# Altium schematic sheet Display.SchDoc
size A3; SheetNumber: 1; SheetTotal: 1
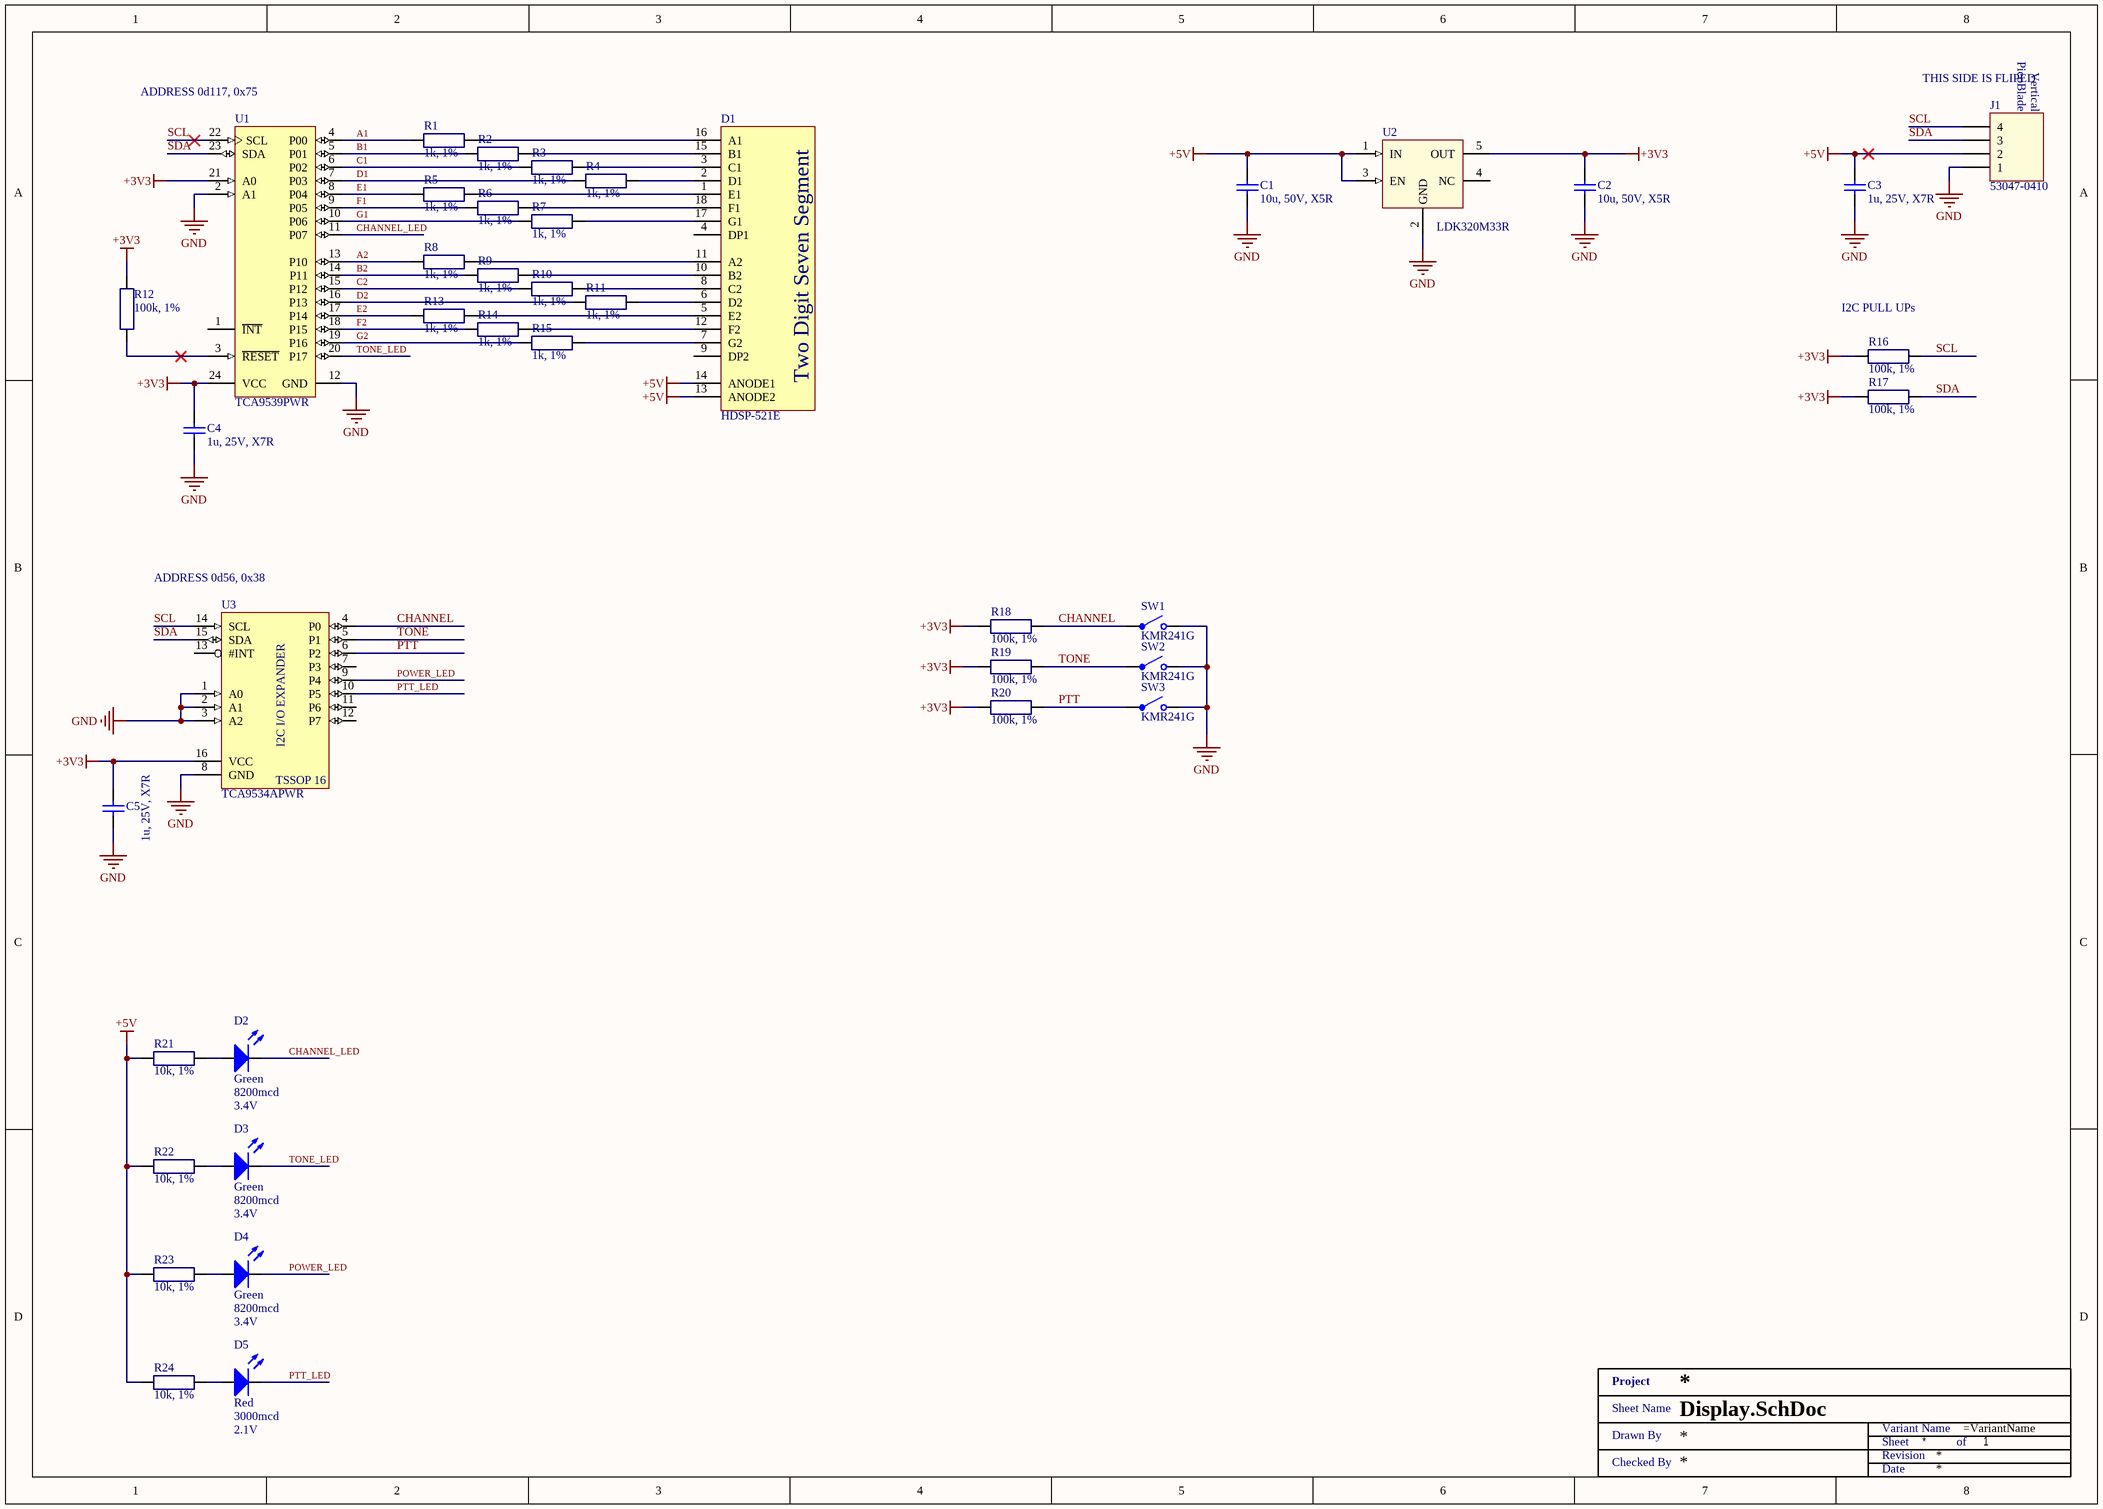
[diagram p0: Display.SchDoc]

## Parts
C1  10u, 50V, X5R  [SMD1206]
C2  10u, 50V, X5R  [SMD1206]
C3  1u, 25V, X7R  [SMD0603]
C4  1u, 25V, X7R  [SMD0603]
C5  1u, 25V, X7R  [SMD0603]
D1  HDSP-521E  [HDSP-521E]
D2  Green  Luminous Intensity: 8200mcd  Forward Voltage: 3.4V  [Cree C566D green]
D3  Green  Luminous Intensity: 8200mcd  Forward Voltage: 3.4V  [Cree C566D green]
D4  Green  Luminous Intensity: 8200mcd  Forward Voltage: 3.4V  [Cree C566D green]
D5  Red  Luminous Intensity: 3000mcd  Forward Voltage: 2.1V  [Cree C566D RED]
J1  53047-0410  [530470410]
R1  1k, 1%  [SMD0603 - R]
R2  1k, 1%  [SMD0603 - R]
R3  1k, 1%  [SMD0603 - R]
R4  1k, 1%  [SMD0603 - R]
R5  1k, 1%  [SMD0603 - R]
R6  1k, 1%  [SMD0603 - R]
R7  1k, 1%  [SMD0603 - R]
R8  1k, 1%  [SMD0603 - R]
R9  1k, 1%  [SMD0603 - R]
R10  1k, 1%  [SMD0603 - R]
R11  1k, 1%  [SMD0603 - R]
R12  100k, 1%  [SMD0603 - R]
R13  1k, 1%  [SMD0603 - R]
R14  1k, 1%  [SMD0603 - R]
R15  1k, 1%  [SMD0603 - R]
R16  100k, 1%  [SMD0603 - R]
R17  100k, 1%  [SMD0603 - R]
R18  100k, 1%  [SMD0603 - R]
R19  100k, 1%  [SMD0603 - R]
R20  100k, 1%  [SMD0603 - R]
R21  10k, 1%  [SMD0603 - R]
R22  10k, 1%  [SMD0603 - R]
R23  10k, 1%  [SMD0603 - R]
R24  10k, 1%  [SMD0603 - R]
SW1  KMR241G  [KMR2]
SW2  KMR241G  [KMR2]
SW3  KMR241G  [KMR2]
U1  TCA9539PWR  [PW0024A_M]
U2  LDK320M33R  [SOT23-5]
U3  TCA9534APWR  [TSSOP16N]
XX?  Title 1  (value not drawn)  (graphical)

## Nets
+3V3: C2.2 C4.1 C5.1 R12.1 R16.1 R17.1 R18.2 R19.2 R20.2 U1.21(A0) U1.24(VCC) U2.5(OUT) U3.16(VCC)
+5V: C1.2 C3.1 D1.13(ANODE2) D1.14(ANODE1) J1.2 R21.1 R22.1 R23.1 R24.1 U2.1(IN) U2.3(EN)
GND: C1.1 C2.1 C3.2 C4.2 C5.2 J1.1 SW1.2 SW2.2 SW3.2 U1.2(A1) U1.12(GND) U2.2(GND) U3.1(A0) U3.2(A1) U3.3(A2) U3.8(GND)
A1: R1.2 U1.4(P00)
A2: R8.2 U1.13(P10)
B1: R2.2 U1.5(P01)
B2: R9.2 U1.14(P11)
C1: R3.2 U1.6(P02)
C2: R10.2 U1.15(P12)
CHANNEL: R18.1 SW1.1 U3.4(P0)
CHANNEL_LED: D2.2(K) U1.11(P07)
D1: R4.2 U1.7(P03)
D2: R11.2 U1.16(P13)
E1: R5.2 U1.8(P04)
E2: R13.2 U1.17(P14)
F1: R6.2 U1.9(P05)
F2: R14.2 U1.18(P15)
G1: R7.2 U1.10(P06)
G2: R15.2 U1.19(P16)
POWER_LED: D4.2(K) U3.9(P4)
PTT: R20.1 SW3.1 U3.6(P2)
PTT_LED: D5.2(K) U3.10(P5)
SCL: J1.4 R16.2 U1.22(SCL) U3.14(SCL)
SDA: J1.3 R17.2 U1.23(SDA) U3.15(SDA)
TONE: R19.1 SW2.1 U3.5(P1)
TONE_LED: D3.2(K) U1.20(P17)
NetD1_1: D1.1(E1) R5.1
NetD1_2: D1.2(D1) R4.1
NetD1_3: D1.3(C1) R3.1
NetD1_5: D1.5(E2) R13.1
NetD1_6: D1.6(D2) R11.1
NetD1_7: D1.7(G2) R15.1
NetD1_8: D1.8(C2) R10.1
NetD1_10: D1.10(B2) R9.1
NetD1_11: D1.11(A2) R8.1
NetD1_12: D1.12(F2) R14.1
NetD1_15: D1.15(B1) R2.1
NetD1_16: D1.16(A1) R1.1
NetD1_17: D1.17(G1) R7.1
NetD1_18: D1.18(F1) R6.1
NetD2_1: D2.1(A) R21.2
NetD3_1: D3.1(A) R22.2
NetD4_1: D4.1(A) R23.2
NetD5_1: D5.1(A) R24.2
NetR12_2: R12.2 U1.3(~{RESET})

Not connected (* = marked no-connect by the designer): D1 4(DP1) 9(DP2); U1 1(~{INT}); U2 4(NC); U3 7(P3) 11(P6) 12(P7) 13(#INT)

## Notes on the sheet
- (near U1) ADDRESS 0d117, 0x75
- (near J1) THIS SIDE IS FLIPED
- (near R16) I2C PULL UPs
- (near U3) ADDRESS 0d56, 0x38
- (in symbol 53047-0410) PicoBlade; Vertical
- (in symbol HDSP-521E) Two Digit Seven Segment
- (in symbol TCA9534APWR) I2C I/O EXPANDER; TSSOP 16
- (in symbol Title 1) Project; Sheet Name; Variant Name; Drawn By; Sheet; of; Revision; Checked By; Date

## Library data of the parts
C1 C2 = UMK316BBJ106KL-T: CAP CER 10UF 50V X5R 1206; Manufacturer: Taiyo Yuden; Tolerance: 10%; Supplier 1: Mouser; Supplier Part Number 1: 963-UMK316BBJ106KL-T; Manufacturer Part Number: UMK316BBJ106KL-T; RoHS: Yes; Category: Ceramic Capacitors; Stock 1: 207945; Pricing 1: 1=0,42000, 10=0,18000, 100=0,12800, 500=0,11000, 1000=0,09700, 2000=0,08000 (USD); Mount: Surface Mount; Case/Package: 1206; Min Operating Temperature: -55°C; Max Operating Temperature: 85°C; Packaging: Tape and Reel; Capacitance: 10u; Voltage Rating: 50V; Length: 0.126inch; Width: 0.063inch; Thickness: 0.071inch; Lead Free: Lead Free; ComponentLink1URL: http://ds.yuden.co.jp/TYCOMPAS/ut/detail.do?productNo=UMK316BBJ106KL-T&fileName=UMK316BBJ106KL-T_SS&mode=specSheetDownload&src-supplier=Digi-Key; ComponentLink1Description: http://ds.yuden.co.jp/TYCOMPAS/ut/detail.do?productNo=UMK316BBJ106KL-T&fileName=UMK316BBJ106KL-T_SS&mode=specSheetDownload&src-supplier=Digi-Key; ComponentLink2URL: https://www.yuden.co.jp/productdata/catalog/mlcc01_e.pdf?src-supplier=Digi-Key; ComponentLink2Description: https://www.yuden.co.jp/productdata/catalog/mlcc01_e.pdf?src-supplier=Digi-Key; ComponentLink3URL: http://www.yuden.co.jp/productdata/catalog/en/mlcc_all_e.pdf?src-supplier=Digi-Key; ComponentLink3Description: http://www.yuden.co.jp/productdata/catalog/en/mlcc_all_e.pdf?src-supplier=Digi-Key; Supplier 2: Digi-Key; Supplier Part Number 2: 587-5960-1-ND; Supplier 3: Avnet; Supplier Part Number 3: UMK316BBJ106KL-T
C3-C5 = CGA3E1X7R1E105K080AC: CAP CER 1UF 25V X7R 0603; Manufacturer: TDK Corporation; Tolerance: ±10%; Manufacturer Part Number: CGA3E1X7R1E105K080AC; RoHS: RoHS Compliant; Category: Capacitors; Stock 1: 109509; Pricing 1: 1=0.2, 10=0.135, 100=0.0686, 500=0.04696, 1000=0.04154 (USD); Packaging: Cut Tape (CT); Part Status: Active; Voltage - Rated: 25V; Temperature Coefficient: X7R; Operating Temperature: -55°C ~ 125°C; Features: -; Ratings: AEC-Q200; Applications: Automotive; Failure Rate: -; Mounting Type: Surface Mount, MLCC; Package / Case: 0603 (1608 Metric); Size / Dimension: 0.063" L x 0.032" W (1.60mm x 0.80mm); Height - Seated (Max): -; Thickness (Max): 0.035" (0.90mm); Lead Spacing: -; Lead Style: -; ComponentLink1URL: https://product.tdk.com/info/en/catalog/datasheets/mlcc_automotive_general_en.pdf; ComponentLink1Description: https://product.tdk.com/info/en/catalog/datasheets/mlcc_automotive_general_en.pdf; Capacitance: 1u; Supplier 1: Mouser; Supplier Part Number 1: 810-CGA3E1X7R1E105K; Supplier 2: Farnell; Supplier Part Number 2: 2346962; Supplier 3: Digi-Key; Supplier Part Number 3: 445-6931-1-ND
D1 = HDSP-521E: Displays Segmented Panel 2DIGIT 16LED Hi-Eff. Red CA 18-Pin DIP Tube; Manufacturer: Broadcom Avago; Forward Voltage: 2.05V; Luminous Intensity: 4mcd; Max Power Dissipation: 62.5mW; Forward Current: 20mA; Number of Characters: 2; Test Current: 10mA; Element Configuration: Common Anode; Wavelength: 628nm; Character Height: 18.6mm; Number of Elements: 16; Number of Segments: 14; Character Width: 7.8mm; Reverse Voltage: 5V; Viewing Area (height): 14.22mm; Supplier 1: Mouser; Supplier Part Number 1: 630-HDSP-521E; Manufacturer Part Number: HDSP-521E; RoHS: Yes; Category: LED Displays; Stock 1: 3408; Pricing 1: 1=2.84000, 10=1.90000, 50=1.90000, 100=1.47000, 1000=1.12000, 10000=1.09000 (USD); Mount: Through Hole; Case/Package: DIP; Number of Pins: 18; Color: Red; Min Operating Temperature: -35°C; Max Operating Temperature: 85°C; Packaging: Rail/Tube; Number of Positions: 2; Package Quantity: 200; Illumination Color: Red; Operating Supply Voltage: 2.05V; Power Consumption: 62.5mW; Dominant Wavelength: 628nm; Power Dissipation: 62.5mW; Series: -; Display Type: Segment; Length: 25mm; Width: 0.984inch; Height: 0.732inch; Depth: 18.6mm; Viewing Area Length: 7.8mm; Radiation Hardening: No; REACH SVHC: No SVHC; Lead Free: Lead Free; RoHS Compliant: Yes; Supplier 2: Farnell; Supplier Part Number 2: 1003314; Supplier 3: Digi-Key; Supplier Part Number 3: 516-1206-5-ND; Supplier 4: RSComponents; Supplier Part Number 4: 8305126
D2-D4 = C566D-GFE-CY14Q7S1: 5-mm Oval Color Series Green; Manufacturer: Cree; Number of LEDs: 1; Viewing Angle: 30°; Forward Current: 20mA; Lens Style: Elliptical; Lens Transparency: Clear; Dominant Wavelength: 527nm; Power Rating: 140mW; Reverse Voltage (DC): 5V; Supplier 1: Mouser; Supplier Part Number 1: 941-C566DGFECY14Q7S1; Manufacturer Part Number: C566D-GFE-CY14Q7S1; RoHS: Yes; Category: LEDs; Stock 1: 1161; Mount: Through Hole; Case/Package: Radial; Color: Green; Lens Color: Green; Min Operating Temperature: -40°C; Max Operating Temperature: 85°C; Illumination Color: Green; Packaging: Bulk; Package Quantity: 500; Test Current: 20mA; Wavelength: 527nm; Length: 5.2mm; Width: 4.6mm; Height: 7.8mm; ComponentLink1URL: https://datasheet.ciiva.com/29562/1275c566drffrfegffgfebffbfeaffafe-29562442.pdf?src-supplier=Digi-Key; ComponentLink1Description: https://datasheet.ciiva.com/29562/1275c566drffrfegffgfebffbfeaffafe-29562442.pdf?src-supplier=Digi-Key; Supplier 2: Digi-Key; Supplier Part Number 2: C566D-GFE-CY14Q7S1-ND
D5 = C566D-RFE-CV0X0BB1: 5-mm Oval Color Series Red; Manufacturer: Cree; Number of LEDs: 1; Viewing Angle: 30°; Forward Current: 20mA; Lens Style: Elliptical; Power Rating: 130mW; Reverse Voltage (DC): 5V; Wavelength: 621nm; Lens Transparency: Clear; Supplier 1: Mouser; Supplier Part Number 1: 941-C566DRFECV0X0BB1; Manufacturer Part Number: C566D-RFE-CV0X0BB1; RoHS: Yes; Category: LEDs; Stock 1: 2915; Mount: Through Hole; Case/Package: Radial; Color: Red; Lens Color: Red; Min Operating Temperature: -40°C; Max Operating Temperature: 85°C; Illumination Color: Red; Packaging: Bulk; Package Quantity: 500; Test Current: 20mA; Dominant Wavelength: 621nm; Length: 5.2mm; Width: 4.6mm; Height: 7.8mm; ComponentLink1URL: https://datasheet.ciiva.com/29561/1275c566drffrfegffgfebffbfeaffafe-29561964.pdf?src-supplier=Digi-Key; ComponentLink1Description: https://datasheet.ciiva.com/29561/1275c566drffrfegffgfebffbfeaffafe-29561964.pdf?src-supplier=Digi-Key; Supplier 2: Digi-Key; Supplier Part Number 2: C566D-RFE-CV0X0BB1-ND; Supplier 3: Arrow Electronics; Supplier Part Number 3: C566D-RFE-CV0X0BB1
J1 = 53047-0410: 1.25mm Pitch, PicoBlade PCB Header, Single Row, Vertical, Through Hole, Tin Plating, Friction Lock, 4 Circuits, Tray, 2.30mm PC Tail Length; Manufacturer: Molex; Manufacturer Part Number: 0530470410; Number of Positions: 4; Max Voltage Rating (AC): 125V; Contact Resistance: 20mR; Connector Type: Blade Pin; RoHS: Yes; Category: Headers and Wire Housings; Stock 4: 7971; Pricing 4: 1=0,27000, 10=0,23400, 100=0,18000, 500=0,15400, 1000=0,13000, 5000=0,11200, 10000=0,10400 (USD); Mount: Through Hole; Housing Material: Nylon; Contact Plating: Tin; Contact Material: Bronze; Color: Natural; Housing Color: White; Min Operating Temperature: -40°C; Max Operating Temperature: 85°C; Termination: Solder; Number of Contacts: 4; Packaging: Tray; Number of Rows: 1; Orientation: Straight; Length: 6.75mm; Pitch: 1.25mm; Contact Mating Length: 0.089inch; Depth: 3.2mm; ComponentLink1URL: https://datasheet.ciiva.com/3934/87920530470410-pcb-headers-3934064.pdf?src-supplier=Arrow; ComponentLink1Description: https://datasheet.ciiva.com/3934/87920530470410-pcb-headers-3934064.pdf?src-supplier=Arrow; Supplier 1: Mouser; Supplier Part Number 1: 538-53047-0410; Supplier 2: Farnell; Supplier Part Number 2: 9733060; Supplier 3: Digi-Key; Supplier Part Number 3: WM1733-ND; Supplier 4: Avnet; Supplier Part Number 4: 0530470410
R1-R11 R13-R15 = MCWR06X1001FTL: MULTICOMP - MCWR06X1001FTL - RES, THICK FILM, 1K, 1%, 0.1W, 0603; Voltage Rating: 50; Resistor Case Style: 0603 [1608 Metric]; Power Rating: 100; Product Range: MCWR Series; Temperature Coefficient: ± 100; SVHC: No SVHC (07-Jul-2017)<!--FANDB--><div class="features-and-benefits-container"><div class="features-and-benefits-desc-container"><span class="features-and-benefits-container-desc">SMD Chip Resistor, Thick Film, 1 kohm, 50 V, 0603 [1608 Metric], 100 mW, ± 1; Manufacturer: MULTICOMP; Manufacturer Part Number: MCWR06X1001FTL; RoHS: Y-EX; Stock 1: 134740; Pricing 1: 10=0.0037, 100=0.0022, 500=0.0016, 1000=0.0012, 2500=0.001 (GBP); Resistance: 1k; Resistance Tolerance: ± 1%; Packaging: Cut Tape; Resistor Element Material: Thick Film; Automotive Qualification Standard: -; ComponentLink1URL: http://www.farnell.com/datasheets/1849611.pdf; ComponentLink1Description: http://www.farnell.com/datasheets/1849611.pdf; Supplier 1: Farnell; Supplier Part Number 1: 2447272; Supplier 2: Newark; Supplier Part Number 2: 94X1378
R12 R16-R20 = RC0603FR-07100KL: RES SMD 100K OHM 1% 1/10W 0603; Manufacturer: Yageo; Power (Watts): 0.1W, 1/10W; Temperature Coefficient: ±100ppm/°C; Manufacturer Part Number: RC0603FR-07100KL; RoHS: RoHS Compliant; Category: Resistors; Stock 1: 14618646; Pricing 1: 1=0.1, 10=0.015, 100=0.006, 1000=0.00268, 2500=0.00233 (USD); Packaging: Cut Tape (CT); Part Status: Active; Tolerance: ±1%; Composition: Thick Film; Features: Moisture Resistant; Operating Temperature: -55°C ~ 155°C; Package / Case: 0603 (1608 Metric); Supplier Device Package: 0603; Size / Dimension: 0.063" L x 0.032" W (1.60mm x 0.80mm); Height - Seated (Max): 0.022" (0.55mm); Failure Rate: -; ComponentLink1URL: http://www.yageo.com/documents/recent/PYu-RC_Group_51_RoHS_L_8.pdf; ComponentLink1Description: http://www.yageo.com/documents/recent/PYu-RC_Group_51_RoHS_L_8.pdf; Resistance: 100k; Supplier 1: Mouser; Supplier Part Number 1: 603-RC0603FR-07100KL; Supplier 2: Farnell; Supplier Part Number 2: 9238727; Supplier 3: Digi-Key; Supplier Part Number 3: 311-100KHRCT-ND
R21-R24 = RC0603FR-0710KL: YAGEO (PHYCOMP) - RC0603FR-0710KL - RES, THICK FILM, 10K, 1%, 0.1W, 0603; Voltage Rating: 50; Resistor Case Style: 0603 [1608 Metric]; Power Rating: 100; Product Range: RC Series; Temperature Coefficient: ± 100; SVHC: No SVHC (20-Jun-2016); Manufacturer: YAGEO (PHYCOMP); Manufacturer Part Number: RC0603FR-0710KL; RoHS: YES; Stock 1: 9995; Pricing 1: 5000=0.0025, 25000=0.0014, 50000=0.0013 (GBP); Resistance: 10k; Resistance Tolerance: ± 1%; Packaging: Tape & Reel; Resistor Element Material: Thick Film; Automotive Qualification Standard: -; MSL: MSL 1 - Unlimited<!--FANDB--><div class="features-and-benefits-container"><div class="features-and-benefits-desc-container"><span class="features-and-benefits-container-desc">SMD Chip Resistor, Thick Film, 10 kohm, 50 V, 0603 [1608 Metric], 100 mW, ± 1; ComponentLink1URL: http://past.yageo.com/pdf/PYu-R_Packing_6.pdf; ComponentLink1Description: http://past.yageo.com/pdf/PYu-R_Packing_6.pdf; ComponentLink2URL: http://www.farnell.com/datasheets/2167052.pdf; ComponentLink2Description: http://www.farnell.com/datasheets/2167052.pdf; Supplier 1: Mouser; Supplier Part Number 1: 603-RC0603FR-0710KL; Supplier 2: Farnell; Supplier Part Number 2: 2421850; Supplier 3: Digi-Key; Supplier Part Number 3: 311-10.0KHRCT-ND
SW1-SW3 = KMR241G LFS: C & K COMPONENTS - KMR241G LFS - SWITCH, SMD, 4N, 0.05A, 32VDC, SPST-NO; Illumination: Non Illuminated; Contact Voltage DC Nom: 32; Contact Current Max: 50; Operating Force: 4; Switch Terminals: Solder; SVHC: No SVHC (17-Dec-2015); Actuation Type: Top; Actuator / Cap Colour: Black; Contact Resistance: 100; External Depth: 2.8; External Length / Height: 1.9; External Width: 4.6; Power Rating: 1VA<!--FANDB--><div class="features-and-benefits-container"><div class="features-and-benefits-description"><span class="features-benefits-value">The KMR241G LFS is a micro-miniature SMD Tactile Switch with momentary action and SPST-NO contact arrangement. It has silver-plated gull-wing terminals and grounding pin.</span></div><div class="features-and-benefits-list"><ul class="features-and-benefits-list-list"><li class="features-and-benefits-list-item">Top actuated</li><li class="features-and-benefits-list-item">Excellent tactile feel</li><li class="features-and-benefits-list-item">Ultra low current capabilities</li><li class="features-and-benefits-list-item">300000-cycle Operating life</li><li class="features-and-benefits-list-item">IP40 Protection rating</li></ul></div><div class="features-and-benefits-applications"><ul class="features-and-benefits-value"><li class="features-and-benefits-list-item">Automotive</li><li class="features-and-benefits-list-item">Industrial</li><li class="features-and-benefits-list-item">Medical</li><li class="features-and-benefits-list-item">Portable Devices</li></ul></div></div>; Manufacturer: C & K COMPONENTS; Manufacturer Part Number: KMR241G LFS; RoHS: YES; Stock 1: 40256; Pricing 1: 1=0.384, 50=0.37, 100=0.218, 7000=0.185, 20000=0.181, 30000=0.178, 50000=0.174 (GBP); Product Range: -; Contact Configuration: SPST-NO; Operating Temperature Max: 85; Operating Temperature Min: -40; ComponentLink1URL: http://www.farnell.com/datasheets/1702857.pdf; ComponentLink1Description: http://www.farnell.com/datasheets/1702857.pdf; Supplier 1: Mouser; Supplier Part Number 1: 611-KMR241GLFS; Supplier 2: Farnell; Supplier Part Number 2: 1437637; Supplier 3: Digi-Key; Supplier Part Number 3: CKN10248DKR-ND
U1 = CMP-0314-00251-2: Remote 16-Bit I2C and SMBus, Low-Power I/O Expander with Interrupt Output, Reset & Config. Register, 1.65 to 5.5 V, -40 to 85 degC, 24-pin TSSOP (PW), Green (RoHS & no Sb/Br); Manufacturer: Texas Instruments; Interrupt Output: Yes; SubFamily: I2C IO Expander; I2C Address: 1110 1xx; # of I/Os: 16; Max Frequency(kHz): 400; 5V Tolerant I/O: Yes; ComponentLink1Description: Datasheet; PartNumber: TCA9539PWR; Eco-Plan: Green (RoHS & no Sb/Br); Reset Input: Yes; ComponentLink2Description: Package Specification; Mounting Technology: Surface Mount; PackageReference: PW0024A; DatasheetVersion: SCPS202A; ComponentLink1URL: http://www.ti.com/general/docs/lit/getliterature.tsp?genericPartNumber=TCA9539&fileType=pdf; Vcc range(V): 1.65 to 5.5; Low Power: Yes; Code_JEDEC: MO-153; Configuration Registers: Yes; PackageVersion: revG, Feb-2011; PackageDescription: 24-Pin Thin Small Outline Package 0.65 mm Pitch; Push-Pull I/O Type: Yes; ComponentLink2URL: http://www.ti.com/litv/pdf/mpds177g
U2 = LDK320M33R: IC REG LINEAR 200MA SOT23-5; Manufacturer: STMicroelectronics; Output Configuration: Positive; Output Type: Fixed; Voltage - Input (Max): 18V; Voltage - Output (Min/Fixed): 3.3V; Voltage Dropout (Max): 0.35V @ 200mA; PSRR: 88dB (120Hz); Control Features: Enable; Protection Features: Over Current, Over Temperature; Manufacturer Part Number: LDK320M33R; RoHS: RoHS Compliant; Category: Integrated Circuits (ICs); Stock 1: 5592; Pricing 1: 1=0.85, 10=0.748, 100=0.5733, 500=0.4532, 1000=0.36256 (USD); Packaging: Cut Tape (CT); Part Status: Active; Current - Output: 200mA; Operating Temperature: -40°C ~ 125°C (TJ); Mounting Type: Surface Mount; Package / Case: SC-74A, SOT-753; Supplier Device Package: SOT-23-5; ComponentLink1URL: http://www.st.com/content/ccc/resource/technical/document/datasheet/0e/0c/26/c9/a4/d4/4b/a1/DM00236470.pdf/files/DM00236470.pdf/jcr:content/translations/en.DM00236470.pdf; ComponentLink1Description: http://www.st.com/content/ccc/resource/technical/document/datasheet/0e/0c/26/c9/a4/d4/4b/a1/DM00236470.pdf/files/DM00236470.pdf/jcr:content/translations/en.DM00236470.pdf; Supplier 1: Mouser; Supplier Part Number 1: 511-LDK320M33R; Supplier 2: Farnell; Supplier Part Number 2: 3130011; Supplier 3: Digi-Key; Supplier Part Number 3: 497-17034-1-ND
U3 = TCA9534APWR: IC I/O EXPANDER I2C 8B 16TSSOP; Manufacturer: Texas Instruments; Number of I/Os: 8; Frequency: 400kHz; Supplier 1: Mouser; Supplier Part Number 1: 595-TCA9534APWR; Manufacturer Part Number: TCA9534APWR; Stock 1: 3614; Pricing 1: 1 = 1.25000, 10 = 1.07000, 50 = 1.07000, 100 = 0.81500, 500 = 0.72100, 1000 = 0.56900, 2000 = 0.50500, 10000 = 0.48600, 24000 = 0.47000, 50000 = 0.45500 (USD); RoHS: Yes; Mount: Surface Mount; Case/Package: TSSOP; Number of Pins: 16; Contact Plating: Gold; Min Operating Temperature: -40°C; Max Operating Temperature: 85°C; Packaging: Tape and Reel; Interface: I2C; Number of Outputs: 8; Lead Free: Lead Free; ComponentLink1URL: http://www.ti.com/general/docs/lit/getliterature.tsp?genericPartNumber=TCA9534A&&fileType=pdf&src-supplier=Avnet; ComponentLink1Description: http://www.ti.com/general/docs/lit/getliterature.tsp?genericPartNumber=TCA9534A&&fileType=pdf&src-supplier=Avnet; ComponentLink2URL: http://www.ti.com/lit/ds/symlink/tca9534a.pdf?src-supplier=Digi-Key; ComponentLink2Description: http://www.ti.com/lit/ds/symlink/tca9534a.pdf?src-supplier=Digi-Key; ComponentLink3URL: http://www.ti.com/general/docs/lit/getliterature.tsp?genericPartNumber=TCA9534A&&fileType=pdf&src-supplier=Avnet+Asia; ComponentLink3Description: http://www.ti.com/general/docs/lit/getliterature.tsp?genericPartNumber=TCA9534A&&fileType=pdf&src-supplier=Avnet+Asia; ComponentLink4URL: http://www.ti.com/lit/pdf/sszc003?src-supplier=Digi-Key; ComponentLink4Description: http://www.ti.com/lit/pdf/sszc003?src-supplier=Digi-Key; Supplier 2: Digi-Key; Supplier Part Number 2: 296-40573-1-ND; Supplier 3: Arrow; Supplier Part Number 3: TCA9534APWR